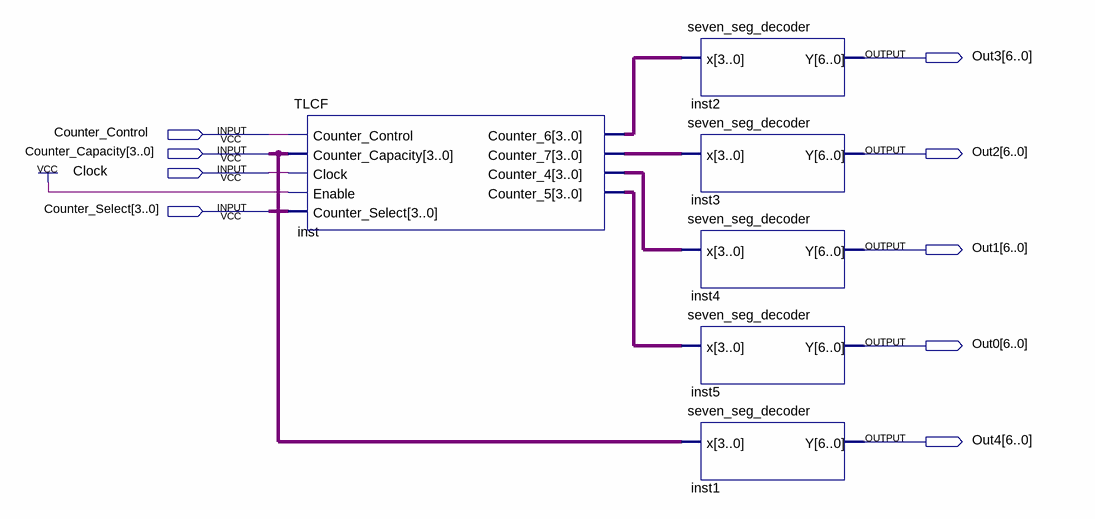
[diagram p0: schematic sheet]
// Quartus schematic TLCF_Test.bdf as structural Verilog: 6 symbols, 9 pins
module TLCF_Test (
  input  Counter_Control,
  input  [3:0] Counter_Capacity,
  input  Clock,
  input  [3:0] Counter_Select,
  output [6:0] Out3,
  output [6:0] Out2,
  output [6:0] Out1,
  output [6:0] Out0,
  output [6:0] Out4
);

  wire [3:0] inst_counter_4, inst_counter_5, inst_counter_6, inst_counter_7;

  TLCF inst (
    .Counter_Control(Counter_Control), .Counter_Capacity(Counter_Capacity), .Clock(Clock), .Enable(1'b1),
    .Counter_Select(Counter_Select), .Counter_6(inst_counter_6), .Counter_7(inst_counter_7),
    .Counter_4(inst_counter_4), .Counter_5(inst_counter_5));
  seven_seg_decoder inst2 (.x(inst_counter_6), .Y(Out3));
  seven_seg_decoder inst3 (.x(inst_counter_7), .Y(Out2));
  seven_seg_decoder inst4 (.x(inst_counter_4), .Y(Out1));
  seven_seg_decoder inst5 (.x(inst_counter_5), .Y(Out0));
  seven_seg_decoder inst1 (.x(Counter_Capacity), .Y(Out4));
endmodule
